# EAGLE schematic iLogger (EAGLE 6.3)

## Sheet 1 of 2
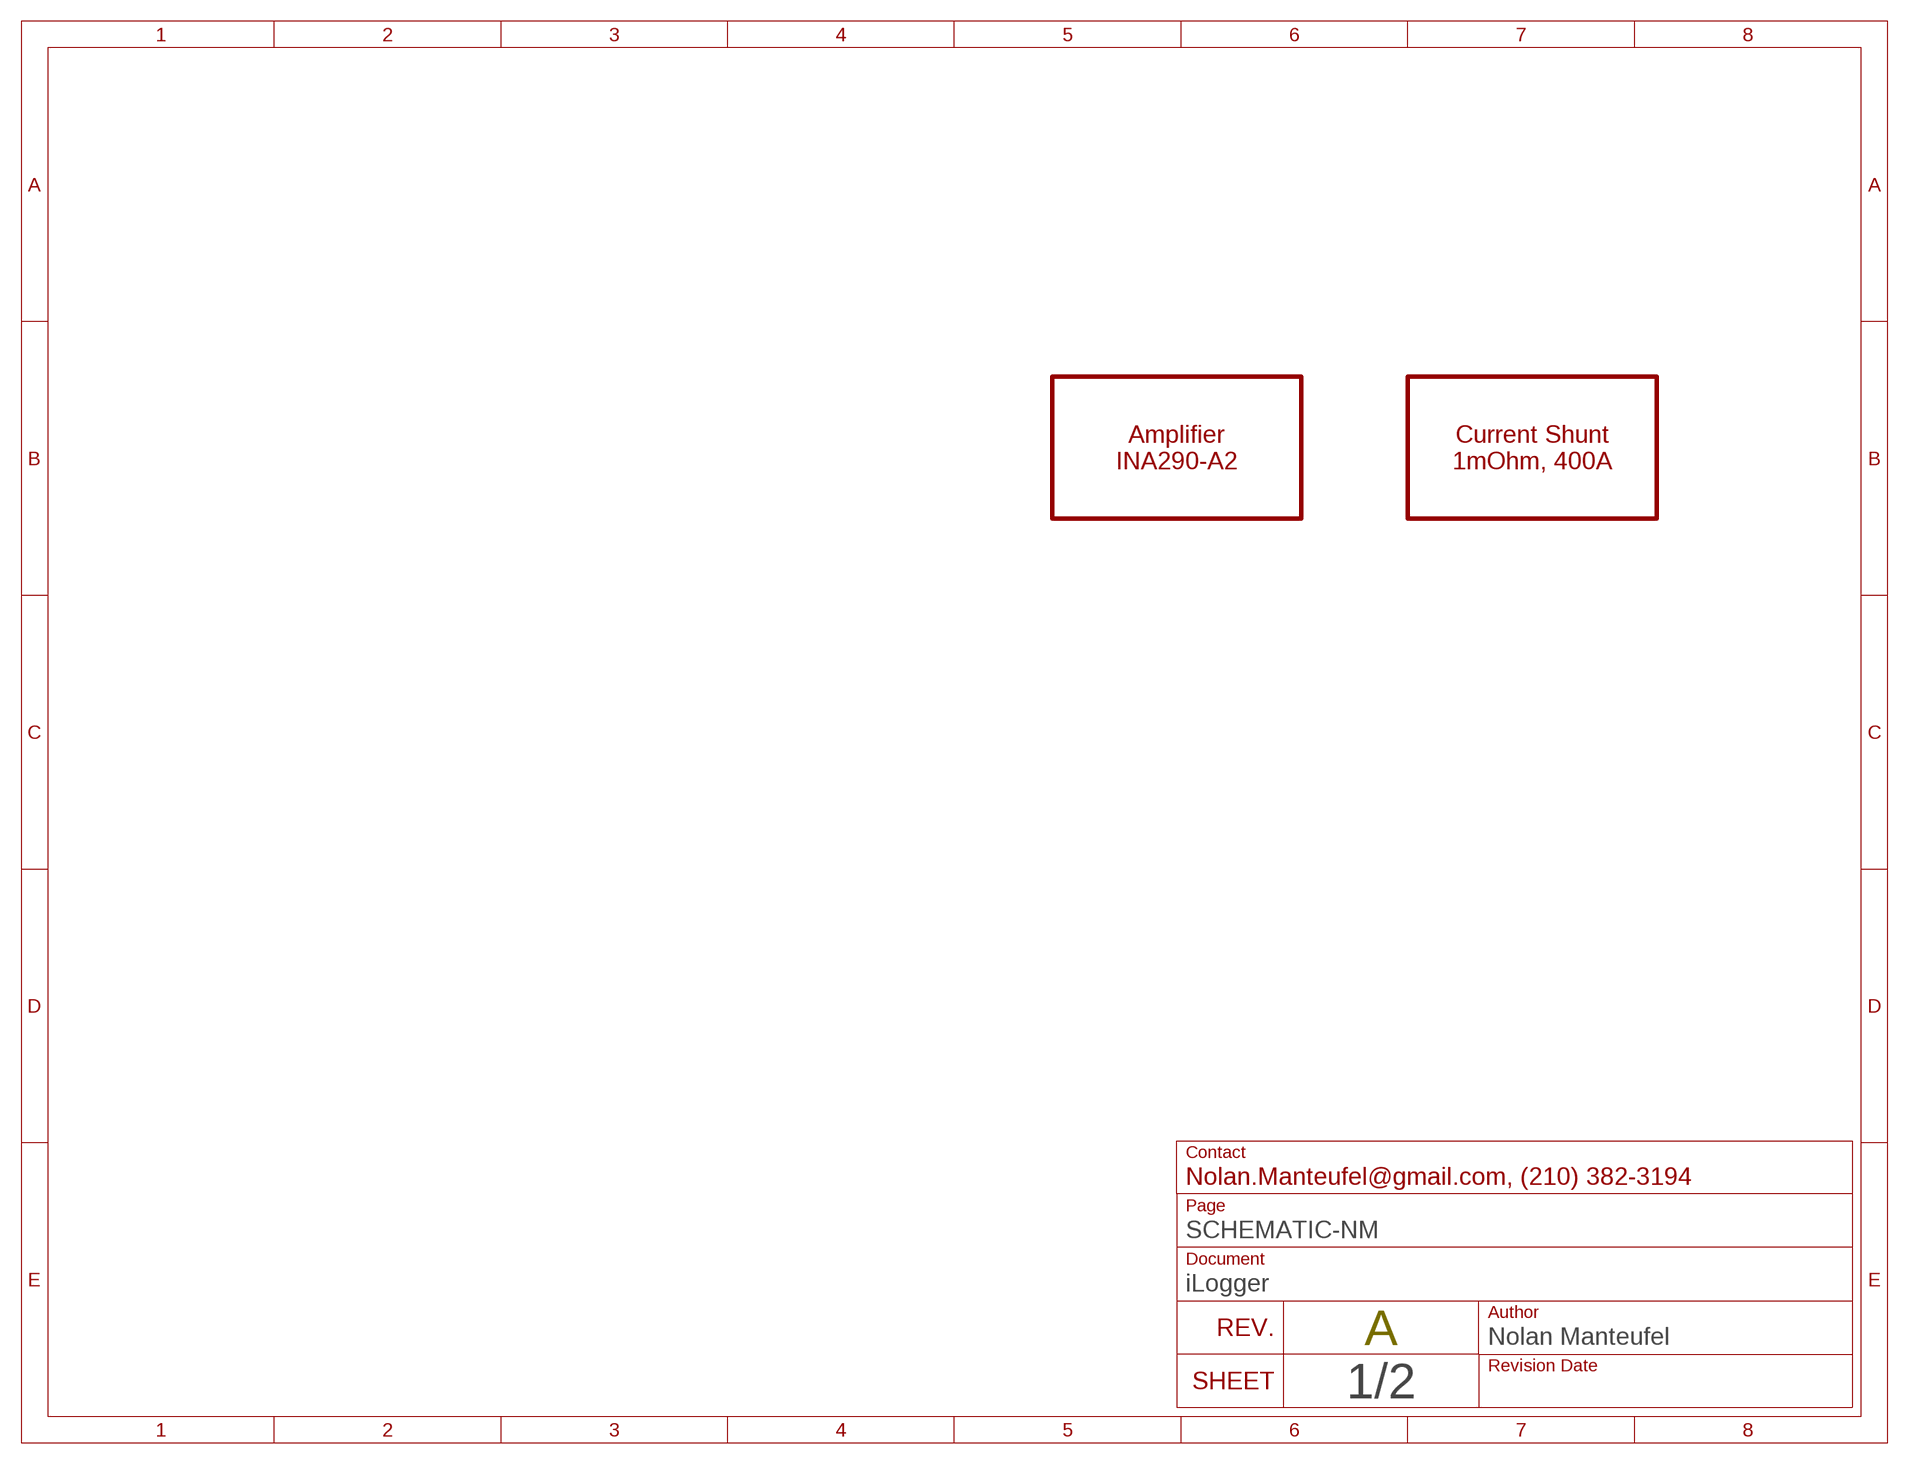
[diagram p0: schematic, sheet 1]

### Notes on the sheet
- Amplifier
  INA290-A2
- Current Shunt
  1mOhm, 400A

## Sheet 2 of 2
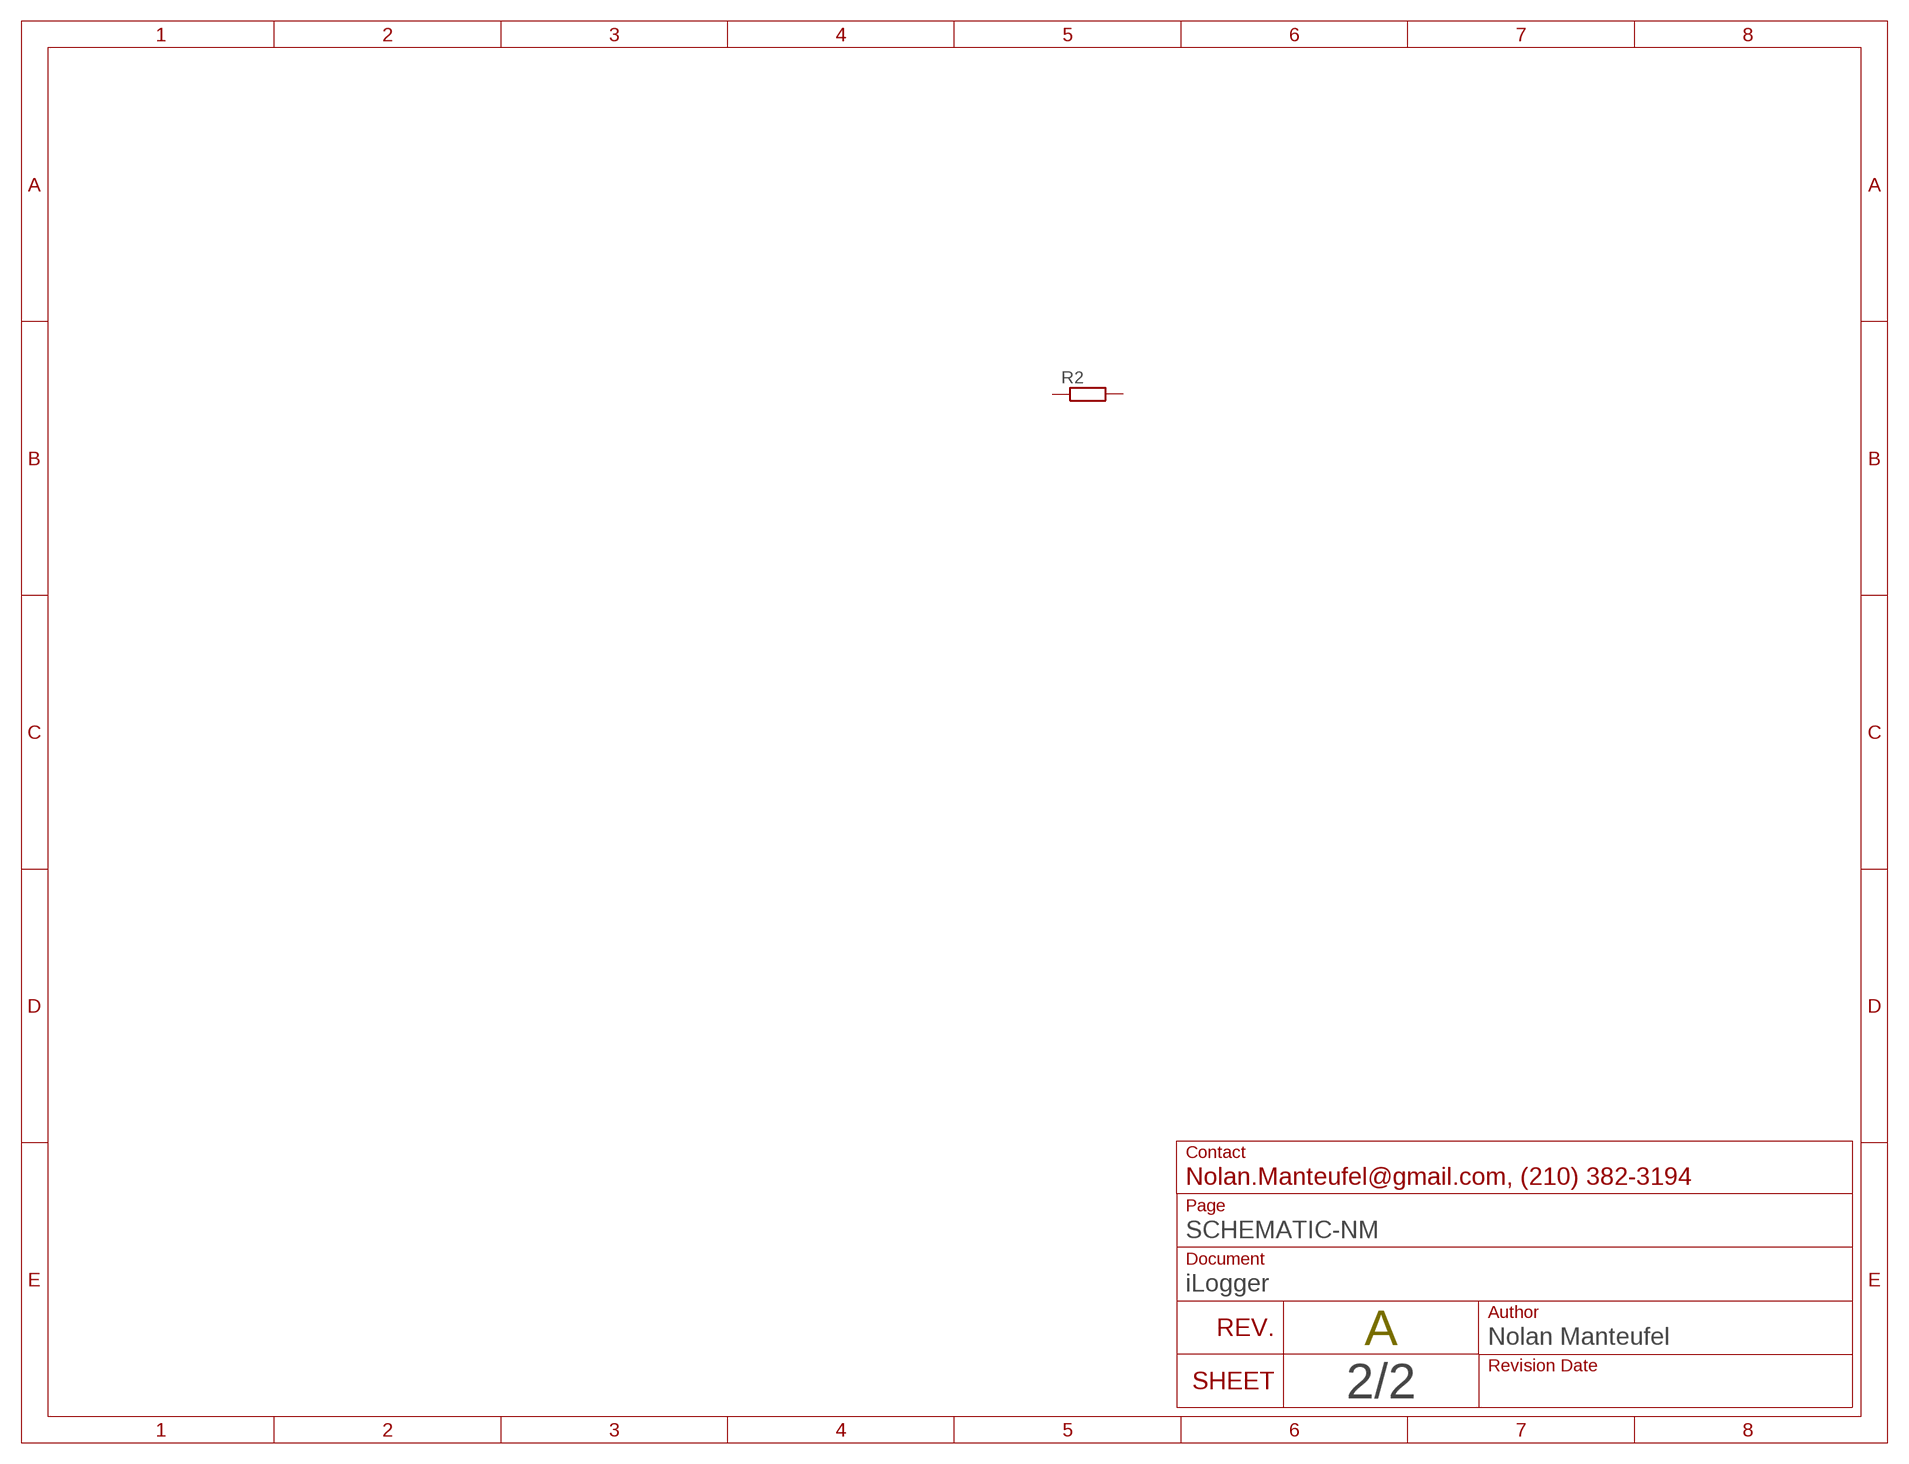
[diagram p1: schematic, sheet 2]

### Parts
R2  R-EU_M1206  [M1206]
Unconnected: R2.1 R2.2

## Library data of the parts
R2 = nolan-utsa:R-EU_: RESISTOR, European symbol